# Altium schematic sheet Secondary_Pad_Auxiliary_Wiring_Overview.SchDoc
size A
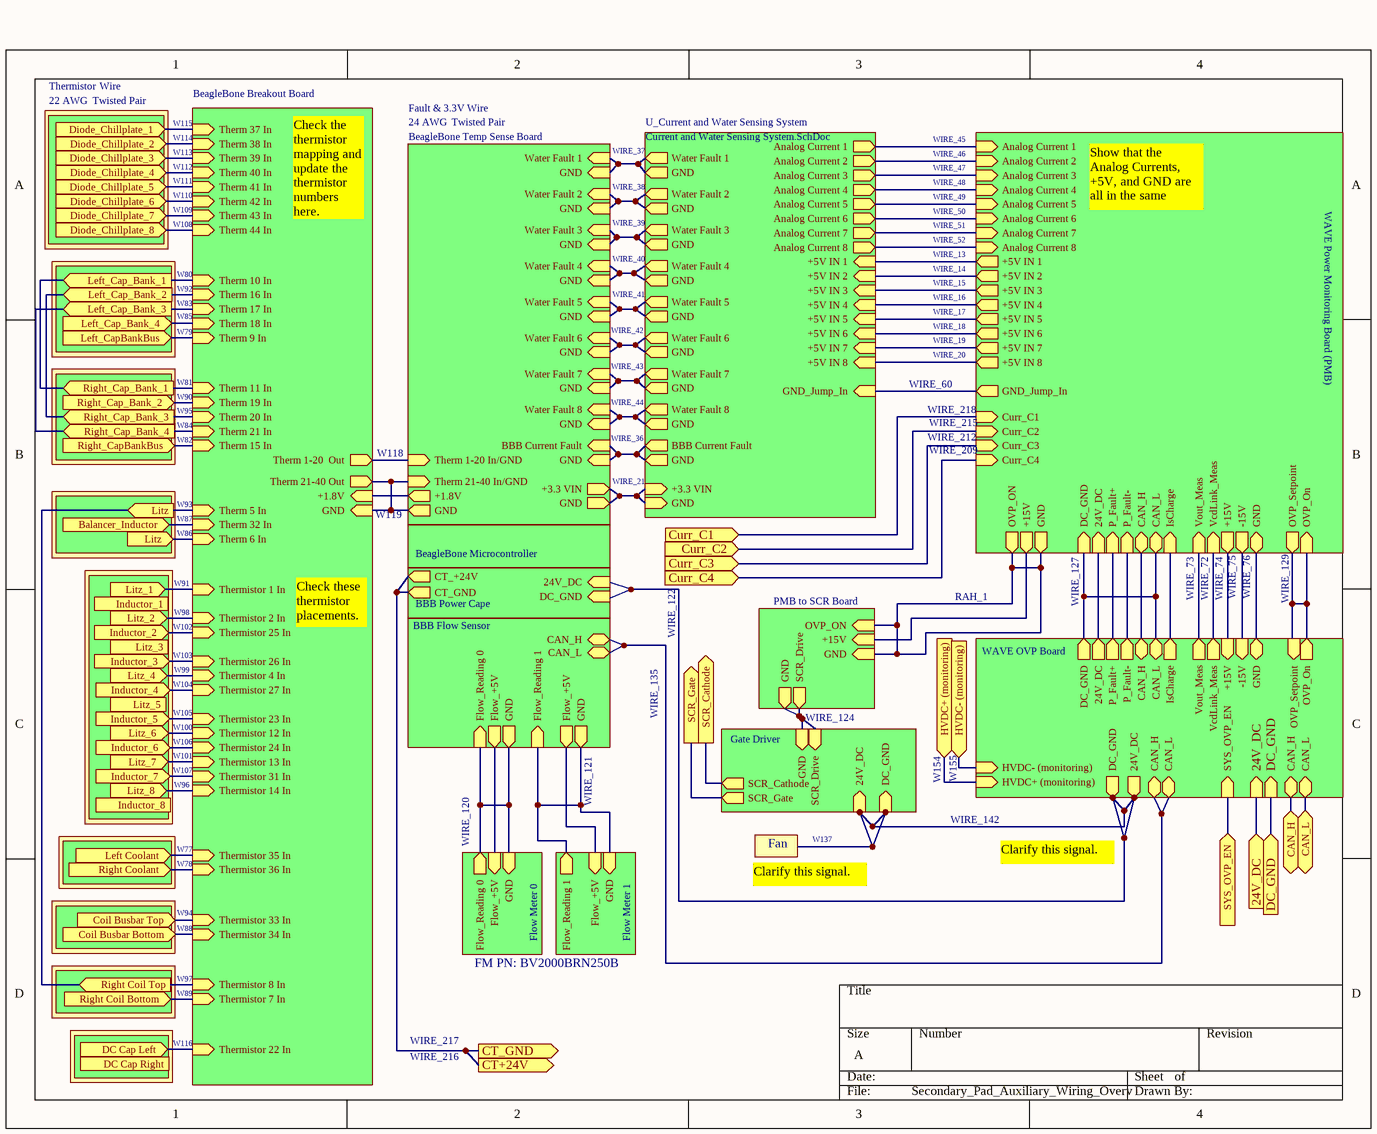
[diagram p0: Secondary_Pad_Auxiliary_Wiring_Overview.SchDoc]

## Sub-sheets
BBB Flow Sensor = File Name: CAN_H (bidir), CAN_L (bidir), Flow_+5V (out), GND (out), Flow_Reading 1 (in), Flow_Reading 0 (in), Flow_+5V (out), GND (out)
BBB Power Cape = File Name: DC_GND (in), 24V_DC (in), CT_GND (out), CT_+24V (out)
BeagleBone Breakout Board = BeagleBone Breakout Board: Therm 37 In (in), Therm 38 In (in), Therm 39 In (in), Therm 40 In (in), Therm 41 In (in), Therm 42 In (in), Therm 43 In (in), Therm 44 In (in), Therm 10 In (in), Therm 16 In (in), Therm 17 In (in), Therm 18 In (in), Therm 9 In (in), Therm 20 In (in), Therm 19 In (in), Therm 11 In (in), Therm 21 In (in), Therm 15 In (in), Therm 5 In (in), Therm 32 In (in), Therm 6 In (in), Thermistor 1 In (in), Thermistor 24 In (in), Thermistor 2 In (in), Thermistor 25 In (in), Thermistor 26 In (in), Thermistor 4 In (in), Thermistor 12 In (in), Thermistor 31 In (in), Thermistor 14 In (in), Thermistor 13 In (in), Therm 1-20  Out (out), Therm 21-40 Out (out), Thermistor 27 In (in), Thermistor 35 In (in), Thermistor 36 In (in), Thermistor 8 In (in), Thermistor 7 In (in), Thermistor 22 In (in), Thermistor 23 In (in), Thermistor 33 In (in), Thermistor 34 In (in), +1.8V (in), GND (in)
BeagleBone Microcontroller = File Name: no entries
BeagleBone Temp Sense Board = File Name: Water Fault 1 (in), Water Fault 5 (in), Water Fault 2 (in), Water Fault 4 (in), Water Fault 6 (in), Water Fault 7 (in), BBB Current Fault (in), Water Fault 8 (in), Therm 1-20 In/GND (in), Therm 21-40 In/GND (in), Water Fault 3 (in), GND (in), GND (in), GND (in), GND (in), GND (in), GND (in), GND (in), GND (in), GND (in), +1.8V (out), GND (out), +3.3 VIN (out), GND (out)
Coil 4 = File Name: no entries
Coil 4 = File Name: no entries
Coil 4 = File Name: no entries
Coil 4 = File Name: no entries
Coil 4 = File Name: no entries
Coil 4 = File Name: no entries
Coil 4 = File Name: no entries
Coil 4 = File Name: no entries
Coil 4 = File Name: no entries
Designator = WAVE OVP Board: Vout_Meas (out), VcdLink_Meas (out), GND (bidir), +15V (in), OVP_On (out), OVP_Setpoint (in), -15V (in), IsCharge (out), P_Fault- (out), P_Fault+ (out), 24V_DC (out), DC_GND (out), CAN_H (bidir), CAN_L (bidir), 24V_DC (in), DC_GND (in), SYS_OVP_EN (in), CAN_H (bidir), CAN_L (bidir), 24V_DC (out), DC_GND (out), CAN_H (bidir), CAN_L (bidir), HVDC- (monitoring) (in), HVDC+ (monitoring) (in)
Flow Meter 0 = File Name: Flow_Reading 0 (out), Flow_+5V (in), GND (in)
Flow Meter 1 = File Name: Flow_Reading 1 (out), Flow_+5V (in), GND (in)
Gate Driver = File Name: SCR_Drive (in), GND (in), SCR_Cathode (out), SCR_Gate (out), DC_GND (in), 24V_DC (in)
PMB to SCR Board = File Name: GND (in), OVP_ON (in), SCR_Drive (out), GND (out), +15V (in)
U_Current and Water Sensing System = Current and Water Sensing System.SchDoc: Water Fault 1 (out), Water Fault 2 (out), Water Fault 3 (out), Water Fault 4 (out), Water Fault 5 (out), Water Fault 6 (out), Water Fault 7 (out), Water Fault 8 (out), BBB Current Fault (out), Analog Current 1 (out), Analog Current 2 (out), Analog Current 3 (out), Analog Current 4 (out), Analog Current 5 (out), Analog Current 6 (out), Analog Current 7 (out), Analog Current 8 (out), +5V IN 1 (in), +5V IN 2 (in), +5V IN 3 (in), +5V IN 4 (in), +5V IN 5 (in), +5V IN 6 (in), +5V IN 7 (in), +5V IN 8 (in), GND (out), GND (out), GND (out), GND (out), GND (out), GND (out), GND (out), GND (out), GND (out), GND_Jump_In (in), +3.3 VIN (in), GND (in)
WAVE Power Monitoring Board (PMB) = File Name: +5V IN 1 (out), +5V IN 2 (out), +5V IN 3 (out), +5V IN 4 (out), +5V IN 5 (out), +5V IN 6 (out), +5V IN 7 (out), +5V IN 8 (out), Vout_Meas (in), VcdLink_Meas (in), GND (bidir), -15V (out), +15V (out), IsCharge (in), P_Fault- (in), P_Fault+ (in), Analog Current 1 (in), Analog Current 2 (in), Analog Current 3 (in), Analog Current 4 (in), Analog Current 5 (in), Analog Current 6 (in), Analog Current 7 (in), Analog Current 8 (in), GND_Jump_In (out), 24V_DC (in), DC_GND (in), OVP_Setpoint (out), OVP_On (in), Curr_C2 (in), Curr_C1 (in), Curr_C4 (in), Curr_C3 (in), CAN_H (bidir), CAN_L (bidir), +15V (out), OVP_ON (out), GND (out)

## Ports
24V_DC (in), Balancer_Inductor (in), CAN_H (bidir), CAN_L (bidir), Coil Busbar Bottom (in), Coil Busbar Top (in), CT+24V (out), CT_GND (out), Curr_C1 (in), Curr_C2 (in), Curr_C3 (in), Curr_C4 (in), DC Cap Left (in), DC Cap Right (in), DC_GND (in), Diode_Chillplate_1 (in), Diode_Chillplate_2 (in), Diode_Chillplate_3 (in), Diode_Chillplate_4 (in), Diode_Chillplate_5 (in), Diode_Chillplate_6 (in), Diode_Chillplate_7 (in), Diode_Chillplate_8 (in), HVDC+ (monitoring) (in), HVDC- (monitoring) (in), Inductor_1 (in), Inductor_2 (in), Inductor_3 (in), Inductor_4 (in), Inductor_5 (in), Inductor_6 (in), Inductor_7 (in), Inductor_8 (in), Left Coolant (in), Left_Cap_Bank_1 (in), Left_Cap_Bank_2 (in), Left_Cap_Bank_3 (in), Left_Cap_Bank_4 (in), Left_CapBankBus (in), Litz (in), Litz_1 (in), Litz_2 (in), Litz_3 (in), Litz_4 (in), Litz_5 (in), Litz_6 (in), Litz_7 (in), Litz_8 (in), Right Coil Bottom (in), Right Coil Top (in), Right Coolant (in), Right_Cap_Bank_1 (in), Right_Cap_Bank_2 (in), Right_Cap_Bank_3 (in), Right_Cap_Bank_4 (in), Right_CapBankBus (in), SCR_Cathode (out), SCR_Gate (out), SYS_OVP_EN (in)

## Nets
24V_DC: port 24V_DC, sheet Designator/24V_DC
Balancer_Inductor: port Balancer_Inductor, sheet BeagleBone Breakout Board/Therm 32 In
CAN_H: port CAN_H, sheet Designator/CAN_H
CAN_L: port CAN_L, sheet Designator/CAN_L
Coil Busbar Bottom: port Coil Busbar Bottom, sheet BeagleBone Breakout Board/Thermistor 34 In
Coil Busbar Top: port Coil Busbar Top, sheet BeagleBone Breakout Board/Thermistor 33 In
CT+24V: port CT_GND, port CT+24V, sheet BBB Power Cape/CT_GND, sheet BBB Power Cape/CT_+24V
Curr_C1: port Curr_C1, sheet WAVE Power Monitoring Board (PMB)/Curr_C1
Curr_C2: port Curr_C2, sheet WAVE Power Monitoring Board (PMB)/Curr_C2
Curr_C3: port Curr_C3, sheet WAVE Power Monitoring Board (PMB)/Curr_C3
Curr_C4: port Curr_C4, sheet WAVE Power Monitoring Board (PMB)/Curr_C4
DC Cap Left: port DC Cap Left, sheet BeagleBone Breakout Board/Thermistor 22 In
DC_GND: port DC_GND, sheet Designator/DC_GND
Diode_Chillplate_1: port Diode_Chillplate_1, sheet BeagleBone Breakout Board/Therm 37 In
Diode_Chillplate_2: port Diode_Chillplate_2, sheet BeagleBone Breakout Board/Therm 38 In
Diode_Chillplate_3: port Diode_Chillplate_3, sheet BeagleBone Breakout Board/Therm 39 In
Diode_Chillplate_4: port Diode_Chillplate_4, sheet BeagleBone Breakout Board/Therm 40 In
Diode_Chillplate_5: port Diode_Chillplate_5, sheet BeagleBone Breakout Board/Therm 41 In
Diode_Chillplate_6: port Diode_Chillplate_6, sheet BeagleBone Breakout Board/Therm 42 In
Diode_Chillplate_7: port Diode_Chillplate_7, sheet BeagleBone Breakout Board/Therm 43 In
Diode_Chillplate_8: port Diode_Chillplate_8, sheet BeagleBone Breakout Board/Therm 44 In
HVDC+ (monitoring): port HVDC+ (monitoring), sheet Designator/HVDC+ (monitoring)
HVDC- (monitoring): port HVDC- (monitoring), sheet Designator/HVDC- (monitoring)
Inductor_2: port Inductor_2, sheet BeagleBone Breakout Board/Thermistor 25 In
Inductor_3: port Inductor_3, sheet BeagleBone Breakout Board/Thermistor 26 In
Inductor_4: port Inductor_4, sheet BeagleBone Breakout Board/Thermistor 27 In
Inductor_5: port Inductor_5, sheet BeagleBone Breakout Board/Thermistor 23 In
Inductor_6: port Inductor_6, sheet BeagleBone Breakout Board/Thermistor 24 In
Inductor_7: port Inductor_7, sheet BeagleBone Breakout Board/Thermistor 31 In
Left Coolant: port Left Coolant, sheet BeagleBone Breakout Board/Thermistor 35 In
Left_Cap_Bank_1: port Right_Cap_Bank_1, port Left_Cap_Bank_1, sheet BeagleBone Breakout Board/Therm 10 In, sheet BeagleBone Breakout Board/Therm 11 In
Left_Cap_Bank_2: port Right_Cap_Bank_3, port Left_Cap_Bank_2, sheet BeagleBone Breakout Board/Therm 16 In, sheet BeagleBone Breakout Board/Therm 20 In
Left_Cap_Bank_3: port Right_Cap_Bank_4, port Left_Cap_Bank_3, sheet BeagleBone Breakout Board/Therm 17 In, sheet BeagleBone Breakout Board/Therm 21 In
Left_Cap_Bank_4: port Left_Cap_Bank_4, sheet BeagleBone Breakout Board/Therm 18 In
Left_CapBankBus: port Left_CapBankBus, sheet BeagleBone Breakout Board/Therm 9 In
Litz: port Litz, port Right Coil Top, sheet BeagleBone Breakout Board/Therm 5 In, sheet BeagleBone Breakout Board/Therm 6 In, sheet BeagleBone Breakout Board/Thermistor 8 In
Litz_1: port Litz_1, sheet BeagleBone Breakout Board/Thermistor 1 In
Litz_2: port Litz_2, sheet BeagleBone Breakout Board/Thermistor 2 In
Litz_4: port Litz_4, sheet BeagleBone Breakout Board/Thermistor 4 In
Litz_6: port Litz_6, sheet BeagleBone Breakout Board/Thermistor 12 In
Litz_7: port Litz_7, sheet BeagleBone Breakout Board/Thermistor 13 In
Litz_8: port Litz_8, sheet BeagleBone Breakout Board/Thermistor 14 In
Right Coil Bottom: port Right Coil Bottom, sheet BeagleBone Breakout Board/Thermistor 7 In
Right Coolant: port Right Coolant, sheet BeagleBone Breakout Board/Thermistor 36 In
Right_Cap_Bank_2: port Right_Cap_Bank_2, sheet BeagleBone Breakout Board/Therm 19 In
Right_CapBankBus: port Right_CapBankBus, sheet BeagleBone Breakout Board/Therm 15 In
SCR_Cathode: port SCR_Cathode, sheet Gate Driver/SCR_Cathode
SCR_Gate: port SCR_Gate, sheet Gate Driver/SCR_Gate
SYS_OVP_EN: port SYS_OVP_EN, sheet Designator/SYS_OVP_EN
(unnamed): sheet BBB Power Cape/24V_DC, sheet Gate Driver/DC_GND, sheet Gate Driver/24V_DC, sheet Designator/24V_DC, sheet Designator/DC_GND
(unnamed): sheet BBB Flow Sensor/CAN_H, sheet BBB Flow Sensor/CAN_L, sheet Designator/CAN_H, sheet Designator/CAN_L
(unnamed): sheet BBB Flow Sensor/Flow_+5V, sheet Flow Meter 0/Flow_+5V
(unnamed): sheet BBB Flow Sensor/GND, sheet BBB Flow Sensor/Flow_Reading 0, sheet Flow Meter 0/Flow_Reading 0, sheet Flow Meter 0/GND
(unnamed): sheet BBB Flow Sensor/Flow_Reading 1, sheet BBB Flow Sensor/GND, sheet Flow Meter 1/Flow_Reading 1, sheet Flow Meter 1/GND
(unnamed): sheet BBB Flow Sensor/Flow_+5V, sheet Flow Meter 1/Flow_+5V
(unnamed): sheet BeagleBone Temp Sense Board/Water Fault 1, sheet BeagleBone Temp Sense Board/GND, sheet U_Current and Water Sensing System/Water Fault 1, sheet U_Current and Water Sensing System/GND
(unnamed): sheet BeagleBone Temp Sense Board/Water Fault 5, sheet BeagleBone Temp Sense Board/GND, sheet U_Current and Water Sensing System/Water Fault 5, sheet U_Current and Water Sensing System/GND
(unnamed): sheet BeagleBone Temp Sense Board/Water Fault 2, sheet BeagleBone Temp Sense Board/GND, sheet U_Current and Water Sensing System/Water Fault 2, sheet U_Current and Water Sensing System/GND
(unnamed): sheet BeagleBone Temp Sense Board/Water Fault 4, sheet BeagleBone Temp Sense Board/GND, sheet U_Current and Water Sensing System/Water Fault 4, sheet U_Current and Water Sensing System/GND
(unnamed): sheet BeagleBone Temp Sense Board/Water Fault 6, sheet BeagleBone Temp Sense Board/GND, sheet U_Current and Water Sensing System/Water Fault 6, sheet U_Current and Water Sensing System/GND
(unnamed): sheet BeagleBone Temp Sense Board/Water Fault 7, sheet BeagleBone Temp Sense Board/GND, sheet U_Current and Water Sensing System/Water Fault 7, sheet U_Current and Water Sensing System/GND
(unnamed): sheet BeagleBone Temp Sense Board/BBB Current Fault, sheet BeagleBone Temp Sense Board/GND, sheet U_Current and Water Sensing System/BBB Current Fault, sheet U_Current and Water Sensing System/GND
(unnamed): sheet BeagleBone Temp Sense Board/Water Fault 8, sheet BeagleBone Temp Sense Board/GND, sheet U_Current and Water Sensing System/Water Fault 8, sheet U_Current and Water Sensing System/GND
(unnamed): sheet BeagleBone Temp Sense Board/Therm 1-20 In/GND, sheet BeagleBone Breakout Board/Therm 1-20  Out
(unnamed): sheet BeagleBone Temp Sense Board/Therm 21-40 In/GND, sheet BeagleBone Temp Sense Board/GND, sheet BeagleBone Breakout Board/Therm 21-40 Out, sheet BeagleBone Breakout Board/GND
(unnamed): sheet BeagleBone Temp Sense Board/Water Fault 3, sheet BeagleBone Temp Sense Board/GND, sheet U_Current and Water Sensing System/Water Fault 3, sheet U_Current and Water Sensing System/GND
(unnamed): sheet BeagleBone Temp Sense Board/+1.8V, sheet BeagleBone Breakout Board/+1.8V
(unnamed): sheet BeagleBone Temp Sense Board/+3.3 VIN, sheet BeagleBone Temp Sense Board/GND, sheet U_Current and Water Sensing System/+3.3 VIN, sheet U_Current and Water Sensing System/GND
(unnamed): sheet U_Current and Water Sensing System/Analog Current 1, sheet WAVE Power Monitoring Board (PMB)/Analog Current 1
(unnamed): sheet U_Current and Water Sensing System/Analog Current 2, sheet WAVE Power Monitoring Board (PMB)/Analog Current 2
(unnamed): sheet U_Current and Water Sensing System/Analog Current 3, sheet WAVE Power Monitoring Board (PMB)/Analog Current 3
(unnamed): sheet U_Current and Water Sensing System/Analog Current 4, sheet WAVE Power Monitoring Board (PMB)/Analog Current 4
(unnamed): sheet U_Current and Water Sensing System/Analog Current 5, sheet WAVE Power Monitoring Board (PMB)/Analog Current 5
(unnamed): sheet U_Current and Water Sensing System/Analog Current 6, sheet WAVE Power Monitoring Board (PMB)/Analog Current 6
(unnamed): sheet U_Current and Water Sensing System/Analog Current 7, sheet WAVE Power Monitoring Board (PMB)/Analog Current 7
(unnamed): sheet U_Current and Water Sensing System/Analog Current 8, sheet WAVE Power Monitoring Board (PMB)/Analog Current 8
(unnamed): sheet U_Current and Water Sensing System/+5V IN 1, sheet WAVE Power Monitoring Board (PMB)/+5V IN 1
(unnamed): sheet U_Current and Water Sensing System/+5V IN 2, sheet WAVE Power Monitoring Board (PMB)/+5V IN 2
(unnamed): sheet U_Current and Water Sensing System/+5V IN 3, sheet WAVE Power Monitoring Board (PMB)/+5V IN 3
(unnamed): sheet U_Current and Water Sensing System/+5V IN 4, sheet WAVE Power Monitoring Board (PMB)/+5V IN 4
(unnamed): sheet U_Current and Water Sensing System/+5V IN 5, sheet WAVE Power Monitoring Board (PMB)/+5V IN 5
(unnamed): sheet U_Current and Water Sensing System/+5V IN 6, sheet WAVE Power Monitoring Board (PMB)/+5V IN 6
(unnamed): sheet U_Current and Water Sensing System/+5V IN 7, sheet WAVE Power Monitoring Board (PMB)/+5V IN 7
(unnamed): sheet U_Current and Water Sensing System/+5V IN 8, sheet WAVE Power Monitoring Board (PMB)/+5V IN 8
(unnamed): sheet U_Current and Water Sensing System/GND_Jump_In, sheet WAVE Power Monitoring Board (PMB)/GND_Jump_In
(unnamed): sheet WAVE Power Monitoring Board (PMB)/Vout_Meas, sheet Designator/Vout_Meas
(unnamed): sheet WAVE Power Monitoring Board (PMB)/VcdLink_Meas, sheet Designator/VcdLink_Meas
(unnamed): sheet WAVE Power Monitoring Board (PMB)/GND, sheet Designator/GND
(unnamed): sheet WAVE Power Monitoring Board (PMB)/-15V, sheet Designator/-15V
(unnamed): sheet WAVE Power Monitoring Board (PMB)/+15V, sheet Designator/+15V
(unnamed): sheet WAVE Power Monitoring Board (PMB)/IsCharge, sheet Designator/IsCharge
(unnamed): sheet WAVE Power Monitoring Board (PMB)/P_Fault-, sheet Designator/P_Fault-
(unnamed): sheet WAVE Power Monitoring Board (PMB)/P_Fault+, sheet Designator/P_Fault+
(unnamed): sheet WAVE Power Monitoring Board (PMB)/24V_DC, sheet Designator/24V_DC
(unnamed): sheet WAVE Power Monitoring Board (PMB)/DC_GND, sheet WAVE Power Monitoring Board (PMB)/CAN_L, sheet Designator/DC_GND, sheet Designator/CAN_L
(unnamed): sheet WAVE Power Monitoring Board (PMB)/OVP_Setpoint, sheet WAVE Power Monitoring Board (PMB)/OVP_On, sheet Designator/OVP_On
(unnamed): sheet WAVE Power Monitoring Board (PMB)/CAN_H, sheet Designator/CAN_H
(unnamed): sheet WAVE Power Monitoring Board (PMB)/+15V, sheet PMB to SCR Board/+15V
(unnamed): sheet WAVE Power Monitoring Board (PMB)/OVP_ON, sheet WAVE Power Monitoring Board (PMB)/GND, sheet PMB to SCR Board/OVP_ON
(unnamed): sheet PMB to SCR Board/SCR_Drive, sheet PMB to SCR Board/GND, sheet Gate Driver/SCR_Drive, sheet Gate Driver/GND

## Notes on the sheet
- 22 AWG
- Thermistor
- Twisted Pair
- Wire
- W115
- W114
- W113
- 24 AWG
- Fault & 3.3V Wire
- WIRE_37
- WIRE_45
- W112
- W111
- W110
- W109
- Check the thermistor mapping and update the thermistor numbers here.
- WIRE_38
- WIRE_39
- WIRE_46
- WIRE_47
- WIRE_48
- WIRE_49
- WIRE_50
- Show that the Analog Currents, +5V, and GND are all in the same insulated jacket.
- W108
- W80
- W92
- WIRE_40
- WIRE_41
- WIRE_13
- WIRE_14
- WIRE_15
- WIRE_51
- WIRE_52
- W83
- W85
- W79
- WIRE_42
- WIRE_43
- WIRE_16
- WIRE_17
- WIRE_18
- WIRE_20
- WIRE_19
- W81
- W90
- W95
- W84
- W82
- WIRE_44
- WIRE_36
- WIRE_60
- WIRE_218
- WIRE_212
- WIRE_215
- W93
- W118
- WIRE_21
- WIRE_209
- W91
- W87
- W86
- W119
- W102
- W98
- Check these thermistor placements.
- WIRE_122
- RAH_1
- WIRE_127
- WIRE_73
- WIRE_72
- WIRE_74
- WIRE_75
- WIRE_76
- WIRE_129
- W103
- W104
- W105
- W100
- W99
- WIRE_135
- WIRE_124
- W106
- W101
- W107
- W96
- W154
- W155
- W77
- W78
- WIRE_120
- WIRE_121
- Fan
- W137
- WIRE_142
- Clarify this signal.
- W94
- W88
- W97
- W89
- FM PN: BV2000BRN250B
- W116
- WIRE_217
- WIRE_216